# EAGLE design simple_module_tester (EAGLE 7.7.0)
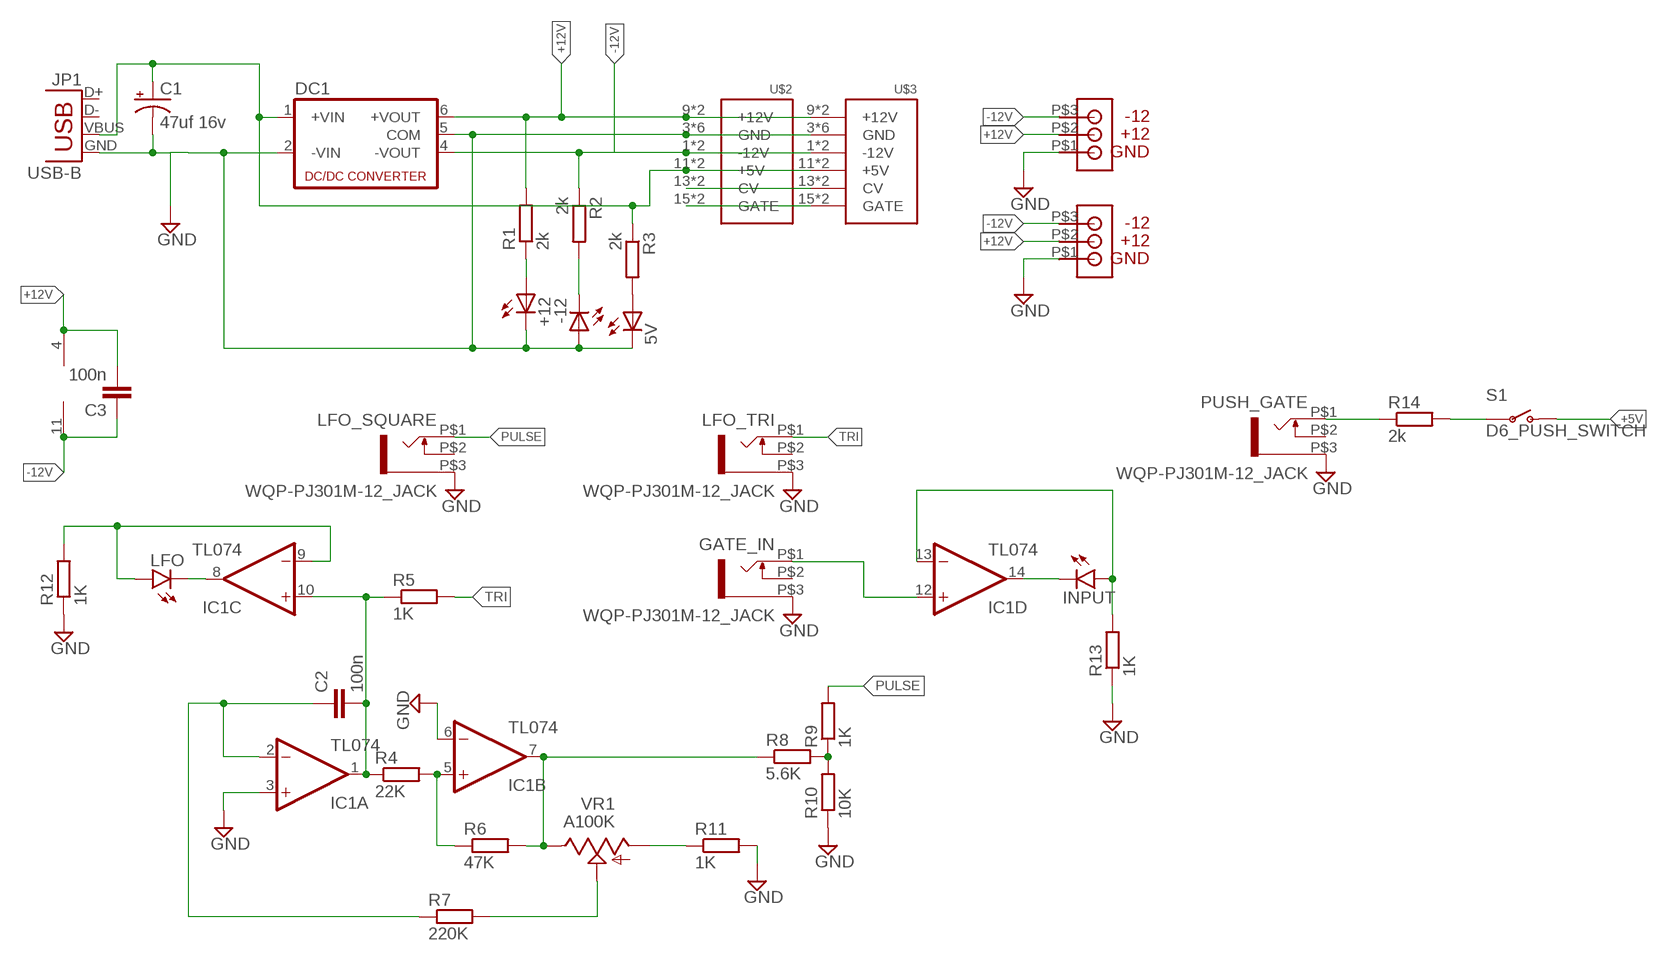
[diagram p0: schematic, sheet 1]

## Parts
5V  LED3MM  [LED3MM]
+12  LED3MM  [LED3MM]
-12  LED3MM  [LED3MM]
C1  47uf 16v  050  [050_020]
C2  100n  CAP_  [AXIAL-5MM]
C3  100n  CAP_  [AXIAL-5MM]
DC1  NMA  [NMA]
GATE_IN  WQP-PJ301M-12_JACK  [WQP-PJ301M-12_JACK]
IC1  TL074  TL074_  [DIL14]
INPUT  LED5MM  [LED5MM]
JP1  USB-B  USBPTH  [USB-B-PTH]
LFO  LED5MM  [LED5MM]
LFO_SQUARE  WQP-PJ301M-12_JACK  [WQP-PJ301M-12_JACK]
LFO_TRI  WQP-PJ301M-12_JACK  [WQP-PJ301M-12_JACK]
PUSH_GATE  WQP-PJ301M-12_JACK  [WQP-PJ301M-12_JACK]
R1  2k  RESISTOR7MM  [7MM_RESISTOR]
R2  2k  RESISTOR7MM  [7MM_RESISTOR]
R3  2k  RESISTOR7MM  [7MM_RESISTOR]
R4  22K  RESISTOR7MM  [7MM_RESISTOR]
R5  1K  RESISTOR7MM  [7MM_RESISTOR]
R6  47K  RESISTOR7MM  [7MM_RESISTOR]
R7  220K  RESISTOR7MM  [7MM_RESISTOR]
R8  5.6K  RESISTOR7MM  [7MM_RESISTOR]
R9  1K  RESISTOR7MM  [7MM_RESISTOR]
R10  10K  RESISTOR7MM  [7MM_RESISTOR]
R11  1K  RESISTOR7MM  [7MM_RESISTOR]
R12  1K  RESISTOR7MM  [7MM_RESISTOR]
R13  1K  RESISTOR7MM  [7MM_RESISTOR]
R14  2k  RESISTOR7MM  [7MM_RESISTOR]
S1  D6_PUSH_SWITCH  [D6_PUSH_SWITCH]
U$1  TILE_POWER_WIDE  [THREEPAD_WIDE]
U$2  POWER  [POWER_16]
U$3  POWER  [POWER_16]
U$4  TILE_POWER_WIDE  [THREEPAD_WIDE]
VR1  A100K  9MM_SNAP-IN_POT_  [9MM_SNAP-IN_POT]

## Nets
+5V: C1.+ DC1.1(+VIN) JP1.VBUS R3.1 S1.P$1(O) S1.P$2(O) U$2.11(+5V) U$2.12(+5V) U$3.11(+5V) U$3.12(+5V)
+12V [+12V]: C3.P$2 DC1.6(+VOUT) IC1.4(P:V+) R1.2 U$1.P$2 U$2.9(+12V) U$2.10(+12V) U$3.9(+12V) U$3.10(+12V) U$4.P$2
-12V [-12V]: C3.P$1 DC1.4(-VOUT) IC1.11(P:V-) R2.1 U$1.P$3 U$2.1(-12V) U$2.2(-12V) U$3.1(-12V) U$3.2(-12V) U$4.P$3
GND [COM]: 5V.K(C) +12.K(C) -12.A C1.- DC1.2(-VIN) DC1.5(COM) GATE_IN.P$3 IC1.3(A:+IN) IC1.6(B:-IN) JP1.GND LFO_SQUARE.P$3 LFO_TRI.P$3 PUSH_GATE.P$3 R10.1 R11.2 R12.1 R13.1 U$1.P$1 U$2.3(GND) U$2.4(GND) U$2.5(GND) U$2.6(GND) U$2.7(GND) U$2.8(GND) U$3.3(GND) U$3.4(GND) U$3.5(GND) U$3.6(GND) U$3.7(GND) U$3.8(GND) U$4.P$1
N$1: -12.K(C) R2.2
N$2: U$2.13(CV) U$2.14(CV) U$3.13(CV) U$3.14(CV)
N$3: U$2.15(GATE) U$2.16(GATE) U$3.15(GATE) U$3.16(GATE)
N$4: 5V.A R3.2
N$5: +12.A R1.1
N$7: C2.P$1 IC1.2(A:-IN) R7.1
N$8: IC1.5(B:+IN) R4.2 R6.1
N$9: R7.2 VR1.2(S)
N$10: R8.2 R9.1 R10.2
N$11: IC1.9(C:-IN) LFO.A R12.2
N$12: C2.P$2 IC1.1(A:OUT) IC1.10(C:+IN) R4.1 R5.1
N$13: GATE_IN.P$1 IC1.12(D:+IN)
N$14: IC1.8(C:OUT) LFO.K(C)
N$15: R11.1 VR1.1(A)
N$16: IC1.7(B:OUT) R6.2 R8.1 VR1.3(E)
N$17: IC1.14(D:OUT) INPUT.K(C)
N$18: IC1.13(D:-IN) INPUT.A R13.2
N$19: PUSH_GATE.P$1 R14.1
N$20: R14.2 S1.P$3(P) S1.P$4(P)
PULSE: LFO_SQUARE.P$1 R9.2
TRI: LFO_TRI.P$1 R5.2
Unconnected: GATE_IN.P$2 JP1.D+ JP1.D- LFO_SQUARE.P$2 LFO_TRI.P$2 PUSH_GATE.P$2

## Library data of the parts
5V +12 -12 = TomW:LED: LED OSRAM: - CHIPLED LG R971, LG N971, LY N971, LG Q971, LY Q971, LO R971, LY R971 LH N974, LH R974 LS Q976, LO Q976, LY Q976 LO Q996 - Hyper CHIPLED LW Q18S LB Q993, LB Q99A, LB R99A - SideLED LS A670, LO A670, LY A670, LG A670, LP A670 LB A673, LV A673, LT A673, LW A673 LH A674 LY A675 LS A676, LA A676, LO A676, LY A676, LW A676 LS A679, LY A679, LG A679 - Hyper Micro SIDELED® LS Y876, LA Y876, LO Y876, LY Y876 LT Y87S - SmartLED LW L88C, LW L88S LB L89C, LB L89S, LG L890 LS L89K, LO L89K, LY L89K LS L896, LA L896, LO L896, LY L896 - TOPLED LS T670, LO T670, LY T670, LG T670, LP T670 LSG T670, LSP T670, LSY T670, LOP T670, LYG T670 LG T671, LOG T671, LSG T671 LB T673, LV T673, LT T673, LW T673 LH T674 LS T676, LA T676, LO T676, LY T676, LB T676, LH T676, LSB T676, LW T676 LB T67C, LV T67C, LT T67C, LS T67K, LO T67K, LY T67K, LW E67C LS E67B, LA E67B, LO E67B, LY E67B, LB E67C, LV E67C, LT E67C LW T67C LS T679, LY T679, LG T679 LS T770, LO T770, LY T770, LG T770, LP T770 LB T773, LV T773, LT T773, LW T773 LH T774 LS E675, LA E675, LY E675, LS T675 LS T776, LA T776, LO T776, LY T776, LB T776 LHGB T686 LT T68C, LB T68C - Hyper Mini TOPLED® LB M676 - Mini TOPLED Santana® LG M470 LS M47K, LO M47K, LY M47K Source: http://www.osram.convergy.de LUXEON: - LUMILED® LXK2-PW12-R00, LXK2-PW12-S00, LXK2-PW14-U00, LXK2-PW14-V00 LXK2-PM12-R00, LXK2-PM12-S00, LXK2-PM14-U00 LXK2-PE12-Q00, LXK2-PE12-R00, LXK2-PE12-S00, LXK2-PE14-T00, LXK2-PE14-U00 LXK2-PB12-K00, LXK2-PB12-L00, LXK2-PB12-M00, LXK2-PB14-N00, LXK2-PB14-P00, LXK2-PB14-Q00 LXK2-PR12-L00, LXK2-PR12-M00, LXK2-PR14-Q00, LXK2-PR14-R00 LXK2-PD12-Q00, LXK2-PD12-R00, LXK2-PD12-S00 LXK2-PH12-R00, LXK2-PH12-S00 LXK2-PL12-P00, LXK2-PL12-Q00, LXK2-PL12-R00 Source: www.luxeon.com KINGBRIGHT: KA-3528ASYC Source: www.kingbright.com
C1 = gm-caps-electro-pol:050: 0.22 - 100uF Xicon values at Mouser.com: 10V: 10 - 100uF; 16V: 2.2 - 47uF; 25V: 0.47 - 47uF; 50V: 0.22 - 22uF
C2 C3 = SparkFun-Capacitors:CAP: Capacitor Standard 0603 ceramic capacitor, and 0.1" leaded capacitor.
DC1 = dc-dc-converter:NMA: DC-DC CONVERTER; MF: C & D TECHNOLOGIES, INC; MPN: NMA0515SC; OC_FARNELL: 1021434; OC_NEWARK: 61K3064
GATE_IN LFO_SQUARE LFO_TRI PUSH_GATE = thonkiconn:WQP-PJ301M-12_JACK
IC1 = MusicThingModular:TL074: Generic Quad Op Amp
INPUT LFO = SparkFun-LED:LED: LEDs Standard schematic elements and footprints for 5mm, 3mm, 1206, and 0603 sized LEDs. 5mm - Spark Fun Electronics SKU : COM-00529 (and others)
JP1 = SparkFun-Connectors:USB: USB Connectors USB-B-PTH is fully proven SKU : PRT-00139/CONN-08278 USB-miniB is fully proven SKU : PRT-00587 USB-A-PCB is untested. USB-A-H is throughly reviewed, but untested. Spark Fun Electronics SKU : PRT-00437 USB-B-SMT is throughly reviewed, but untested. Needs silkscreen touching up. USB-A-S has not been used/tested USB-MB-H has not been used/tested USB-MICROB has been used. CONN-09505; PROD_ID: CONN-08278
R1-R14 = MusicThingModular:RESISTOR: Standard resistor, various versions
S1 = MusicThingModular:D6_PUSH_SWITCH: Push switch
U$1 U$4 = foxfield:TILE_POWER_WIDE
U$2 U$3 = eurorack:POWER
VR1 = MusicThingModular:9MM_SNAP-IN_POT: 9mm vertical snap-in pot, Alpha / Panasonic style

## Net classes
1 +12V: width 0.61 mm
2 -12V: width 0.61 mm
3 COM: width 0.61 mm

## Board
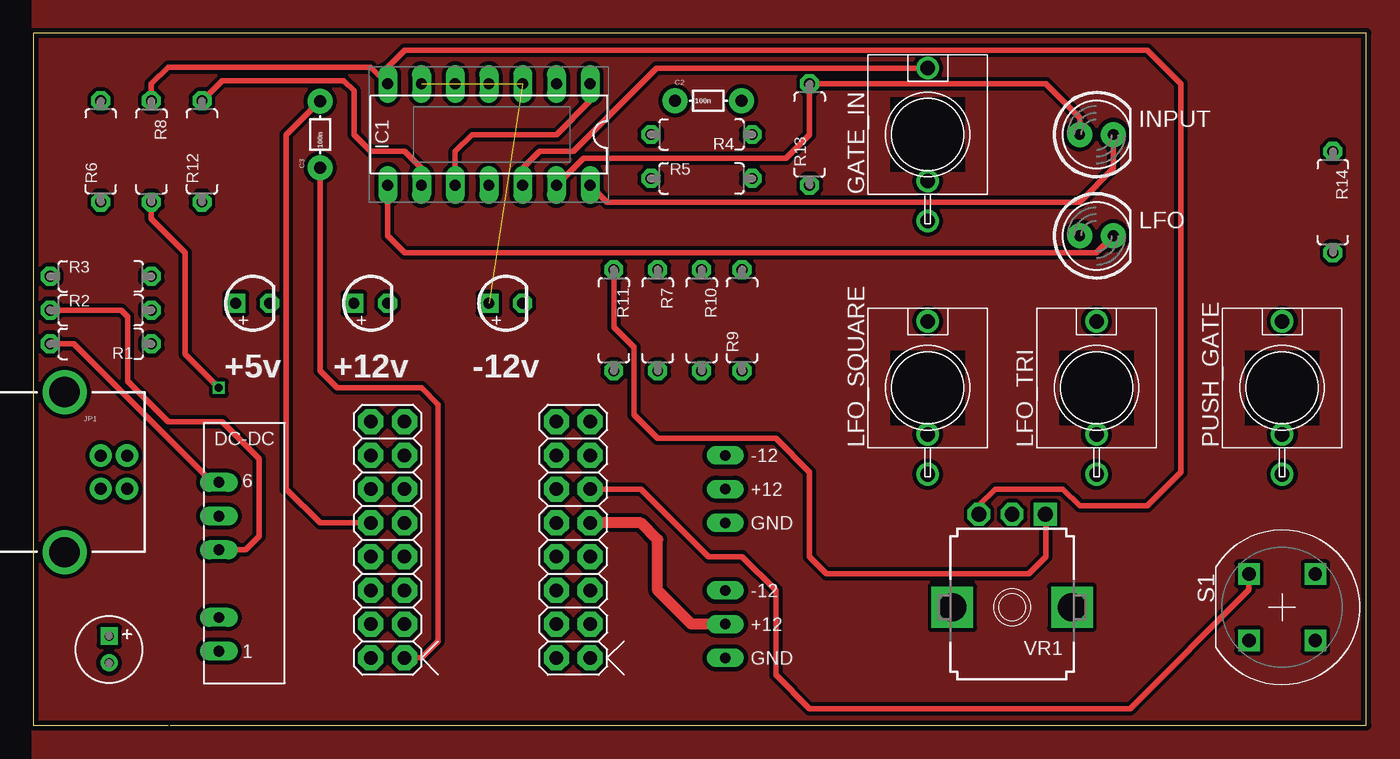
[diagram p1: board, top side]
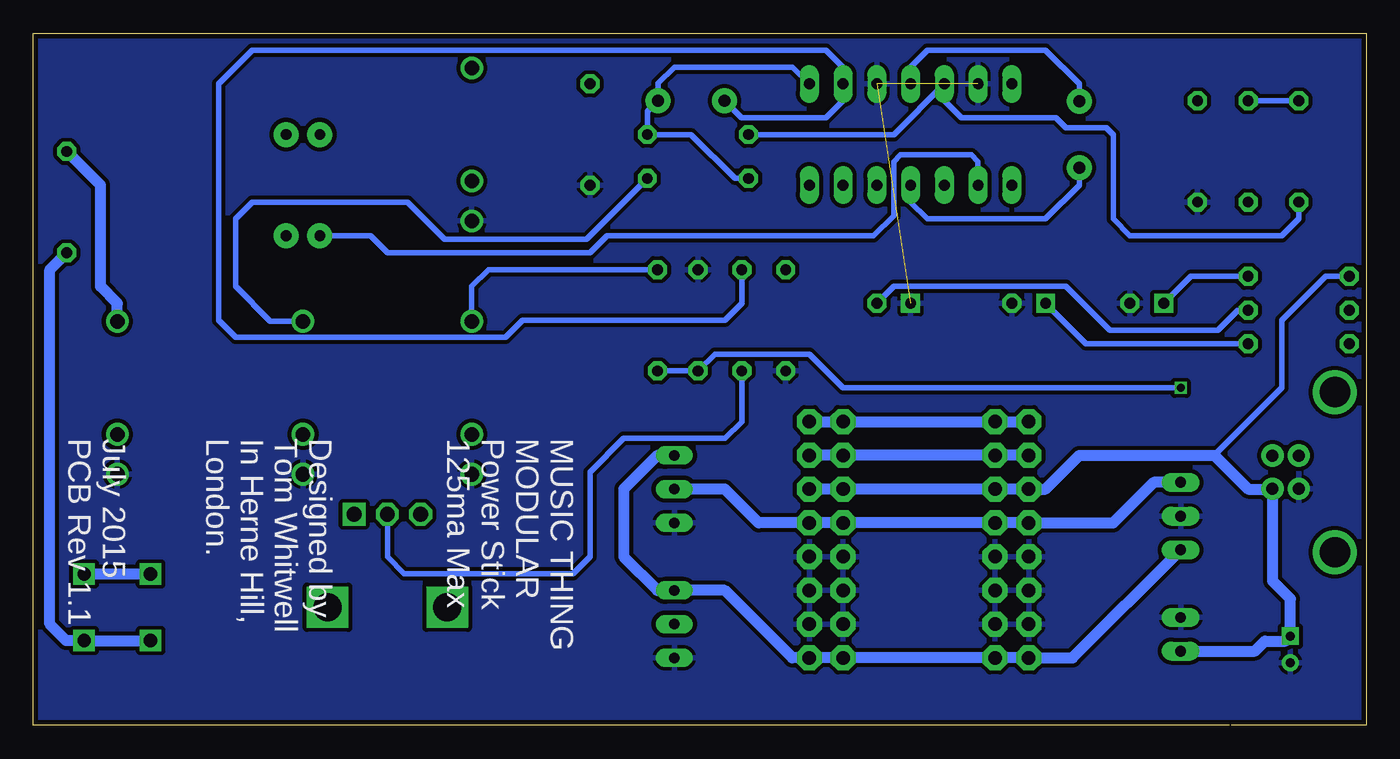
[diagram p2: board, bottom side, seen from below]

Size 100.31 x 52.07 mm. Coordinates in mm from the lower left corner, seen from the top.
Outline: 10.32,0 100.31,0 100.31,52.07 0,52.07 0,0 10.16,0
Copper layers (1*2*15*16): Top 0.035mm / dielectric 0.2mm / Route2 0.0175mm / dielectric 1.1mm / Route15 0.0175mm / dielectric 0.2mm / Bottom 0.035mm
Design rules "MT design rules rev2": minimum track width 6mil, minimum drill 12mil, track to track 12mil, track to pad 12mil, pad to pad 10mil, via to via 10mil, smd to smd 0mil, copper to edge 15mil, drill to drill 13mil, minimum pad ring 12mil, minimum via ring 6mil, stop-mask expansion 2mil, vias tented up to drill 25mil, thermal gap 10mil

### Footprints (pad centres in the part's own frame; a part is rotated, then mirrored left to right if it is on the bottom)
LED3MM = drill 0.813 square: A -1.27,0 | drill 0.813 octagon: K 1.27,0
050_020 = drill 0.7 square: + -1,0 | drill 0.7: - 1,0
AXIAL-5MM = drill 0.9 pad 1.88: P$1 -2.5,0; P$2 2.5,0
NMA = drill 0.813 long: 1 0,6.35; 2 0,3.81; 4 0,-1.27; 5 0,-3.81; 6 0,-6.35
WQP-PJ301M-12_JACK = drill 1.1: P$1 0,5; P$2 0,-3.5; P$3 0,-6.5
DIL14 = drill 0.813 long: 1 -7.62,-3.81; 2 -5.08,-3.81; 3 -2.54,-3.81; 4 0,-3.81; 5 2.54,-3.81; 6 5.08,-3.81; 7 7.62,-3.81; 8 7.62,3.81; 9 5.08,3.81; 10 2.54,3.81; 11 0,3.81; 12 -2.54,3.81; 13 -5.08,3.81; 14 -7.62,3.81
LED5MM = drill 0.813 pad 1.88: A -1.27,0; K 1.27,0
USB-B-PTH = drill 0.914 pad 1.676: D+ 0,1.25; D- 1.981,1.25; GND 0,-1.25; VBUS 1.981,-1.25 | drill 2.286: S1 -2.718,-6.02; S2 -2.718,6.02
7MM_RESISTOR = drill 0.813 octagon: 1 -3.81,0; 2 3.81,0
D6_PUSH_SWITCH = drill 1 square: P$1 -2.5,2.5; P$2 2.5,2.5; P$3 2.5,-2.5; P$4 -2.5,-2.5
THREEPAD_WIDE = drill 0.8 long: P$1 0,0; P$2 0,2.54; P$3 0,5.08
POWER_16 = drill 1.016 pad 1.88 octagon: 1 -6.35,-1.27; 2 -6.35,1.27; 3 -3.81,-1.27; 4 -3.81,1.27; 5 -1.27,-1.27; 6 -1.27,1.27; 7 1.27,-1.27; 8 1.27,1.27; 9 3.81,-1.27; 10 3.81,1.27; 11 6.35,-1.27; 12 6.35,1.27; 13 8.89,-1.27; 14 8.89,1.27; 15 11.43,-1.27; 16 11.43,1.27
9MM_SNAP-IN_POT = drill 1.1 square: 1 -2.5,-7 | drill 1.1 octagon: 2 0,-7; 3 2.5,-7 | drill 2.1 square: CHASSIS1 -4.5,0; CHASSIS2 4.5,0

### Placement (x,y rotation side)
5V  16.51,31.75 0 top
+12  25.4,31.75 0 top
-12  35.56,31.75 0 top
C1  5.71,5.71 270 top
C2  50.8,46.99 0 top
C3  21.59,44.45 90 top
DC1  13.97,11.94 180 top
GATE_IN  67.31,44.45 0 top
IC1  34.29,44.45 180 top
INPUT  80.01,44.45 0 top
JP1  5.08,19.05 0 top
LFO  80.01,36.83 0 top
LFO_SQUARE  67.31,25.4 0 top
LFO_TRI  80.01,25.4 0 top
PUSH_GATE  93.98,25.4 0 top
R1  5.08,28.7 180 top
R2  5.08,31.24 0 top
R3  5.08,33.78 0 top
R4  50.29,44.45 180 top
R5  50.29,41.15 0 top
R6  5.08,43.18 90 top
R7  46.99,30.48 270 top
R8  8.89,43.18 270 top
R9  53.34,30.48 90 top
R10  50.29,30.48 270 top
R11  43.69,30.48 270 top
R12  12.7,43.18 90 top
R13  58.42,44.45 90 top
R14  97.79,39.37 270 top
S1  93.98,8.89 0 top
U$1  52.07,15.24 0 top
U$2  26.67,11.43 90 top
U$3  40.64,11.43 90 top
U$4  52.07,5.08 0 top
VR1  73.66,8.89 180 top

### Tracks (layer width: path | path; a pad name or v marks a point on that pad's centre or on a via)
+5V
  Top 0.406: S1.P$1 91.48,10.2 82.55,1.27 58.42,1.27 55.88,3.81 55.88,10.16 53.34,12.7 50.8,12.7 45.72,17.78 U$3.11
  Bottom 0.406: R3.1 3.05,33.78 6.35,30.48 6.35,25.4 11.43,20.32
  Bottom 0.813: U$3.11 U$3.12 U$2.11 U$2.12 24.13,17.78 21.59,20.32 11.43,20.32 8.89,17.78 7.08,17.78 JP1.VBUS 7.06,10.87 5.71,9.53 C1.+ 6.08,6.35 7.62,6.35 8.38,5.59 DC1.1 | S1.P$1 S1.P$2
+12V
  Top 0.406: DC1.6 13.46,18.29 3.05,28.7 R1.2 | C3.P$2 21.55,46.95 19.05,44.45 19.05,17.78 21.59,15.24 U$2.10
  Top 0.813: U$4.P$2 49.53,7.62 46.99,10.16 46.99,13.97 45.72,15.24 U$3.9
  Bottom 0.406: C3.P$2 21.59,48.26 24.13,50.8 33.02,50.8 34.29,49.53 IC1.4
  Bottom 0.813: U$1.P$2 48.26,17.78 45.72,15.24 U$3.9 U$3.10 U$2.9 U$2.10 19.05,15.24 16,18.29 DC1.6
-12V
  Top 0.406: R2.1 6.6,31.24 7.11,30.73 7.11,25.91 10.16,22.86 14.22,22.86 17.02,20.07 17.02,14.22 16,13.21 DC1.4 | C3.P$1 21.59,26.67 22.86,25.4 29.21,25.4 30.48,24.13 30.48,6.35 29.21,5.08 U$2.1
  Bottom 0.406: C3.P$1 21.59,40.64 24.13,38.1 33.02,38.1 34.29,39.37 IC1.11
  Bottom 0.813: U$1.P$3 53.34,20.32 55.88,17.78 55.88,12.7 53.34,10.16 U$4.P$3 48.26,10.16 43.18,5.08 U$3.1 U$3.2 U$2.1 U$2.2 22.1,5.08 DC1.4
GND  (2 unrouted)
  pour Bottom: 0,57.15 104.14,57.15 104.14,-2.54 0,-2.54
N$1
  Bottom 0.406: R2.2 9.65,31.24 11.18,29.72 19.3,29.72 22.61,33.02 35.56,33.02 -12.K
N$2
  Bottom 0.813: U$2.14 U$2.13 U$3.14 U$3.13
N$3
  Bottom 0.813: U$3.15 U$3.16 U$2.15 U$2.16
N$4
  Bottom 0.406: R3.2 13.21,33.78 5V.A
N$5
  Bottom 0.406: R1.1 21.08,28.7 +12.A
N$7
  Bottom 0.406: R7.1 46.99,31.75 48.26,30.48 63.5,30.48 64.77,29.21 85.09,29.21 86.36,30.48 86.36,48.26 83.82,50.8 40.64,50.8 39.37,49.53 IC1.2 39.37,46.99 40.64,45.72 47.03,45.72 C2.P$1
N$8
  Bottom 0.406: R6.1 5.08,38.1 6.35,36.83 17.78,36.83 19.05,38.1 19.05,44.45 19.56,44.96 22.61,44.96 23.37,45.72 30.48,45.72 31.75,46.99 IC1.5 35.56,44.45 R4.2
N$9
  Bottom 0.406: R7.2 46.99,22.86 48.26,21.59 55.88,21.59 58.42,19.05 58.42,12.7 59.69,11.43 72.39,11.43 73.66,12.7 VR1.2
N$10  (via drill 0.6)
  Top 0.406: R8.2 8.89,38.1 11.43,35.56 11.43,27.94 v13.97,25.4
  Bottom 0.406: R9.1 R10.2 49.02,27.94 41.91,27.94 39.37,25.4 v13.97,25.4
N$11
  Top 0.406: IC1.9 29.21,41.91 27.94,43.18 25.4,43.18 24.13,44.45 24.13,47.75 23.37,48.51 14.22,48.51 R12.2
  Bottom 0.406: LFO.A 74.93,36.83 73.66,35.56 58.42,35.56 57.15,36.83 37.08,36.83 35.56,38.35 35.56,42.42 35.05,42.93 29.72,42.93 29.21,42.42 IC1.9
N$12
  Top 0.406: IC1.10 31.75,43.18 33.02,44.45 39.37,44.45 41.91,46.99 IC1.1
  Bottom 0.406: IC1.1 43.18,49.53 52.07,49.53 53.3,48.3 C2.P$2 54.1,46.19 R4.1 50.8,44.45 47.5,41.15 R5.1
N$13
  Top 0.406: GATE_IN.P$1 46.91,49.45 40.64,43.18 38.1,43.18 36.83,41.91 IC1.12
N$14
  Top 0.406: IC1.8 26.67,36.83 27.94,35.56 80.01,35.56 LFO.K
N$15
  Top 0.406: R11.1 43.69,29.97 45.21,28.45 45.21,23.37 46.99,21.59 55.88,21.59 58.42,19.05 58.42,12.7 59.69,11.43 74.93,11.43 76.2,12.7 76.2,15.85 VR1.1
N$16
  Top 0.406: R8.1 8.89,48.26 10.16,49.53 25.4,49.53 IC1.7 26.67,49.53 27.94,50.8 83.82,50.8 86.36,48.26 86.36,19.05 83.82,16.51 78.74,16.51 77.47,17.78 72.39,17.78 71.16,16.55 VR1.3
  Bottom 0.406: R6.2 R8.1
N$17
  Top 0.406: IC1.14 43.18,39.37 78.74,39.37 81.28,41.91 INPUT.K
N$18
  Top 0.406: INPUT.A 78.74,45.72 76.2,48.26 R13.2 58.42,44.45 56.64,42.67 41.4,42.67 IC1.13
N$19
  Bottom 0.813: PUSH_GATE.P$1 93.98,31.75 95.25,33.02 95.25,40.64 R14.1
N$20
  Bottom 0.813: S1.P$4 S1.P$3 97.83,6.39 99.06,7.62 99.06,34.29 R14.2
N$21
  pour Top: 0,-2.54 104.14,-2.54 104.14,57.15 0,57.15
PULSE
  Bottom 0.406: R9.2 66.04,34.29 67.31,33.02 LFO_SQUARE.P$1
TRI
  Bottom 0.406: LFO_TRI.P$1 82.47,30.4 85.09,33.02 85.09,38.1 83.82,39.37 72.14,39.37 69.34,36.58 58.67,36.58 R5.2

### Text on the board
tPlace: +5v | +12v | -12v
bPlace: MUSIC THING / MODULAR / Power Stick / 125ma Max / / / / Designed by / Tom Whitwell / In Herne Hill, / London. / / / July 2015 / PCB Rev 1.1